# Altium schematic sheet HID.SchDoc
size A4
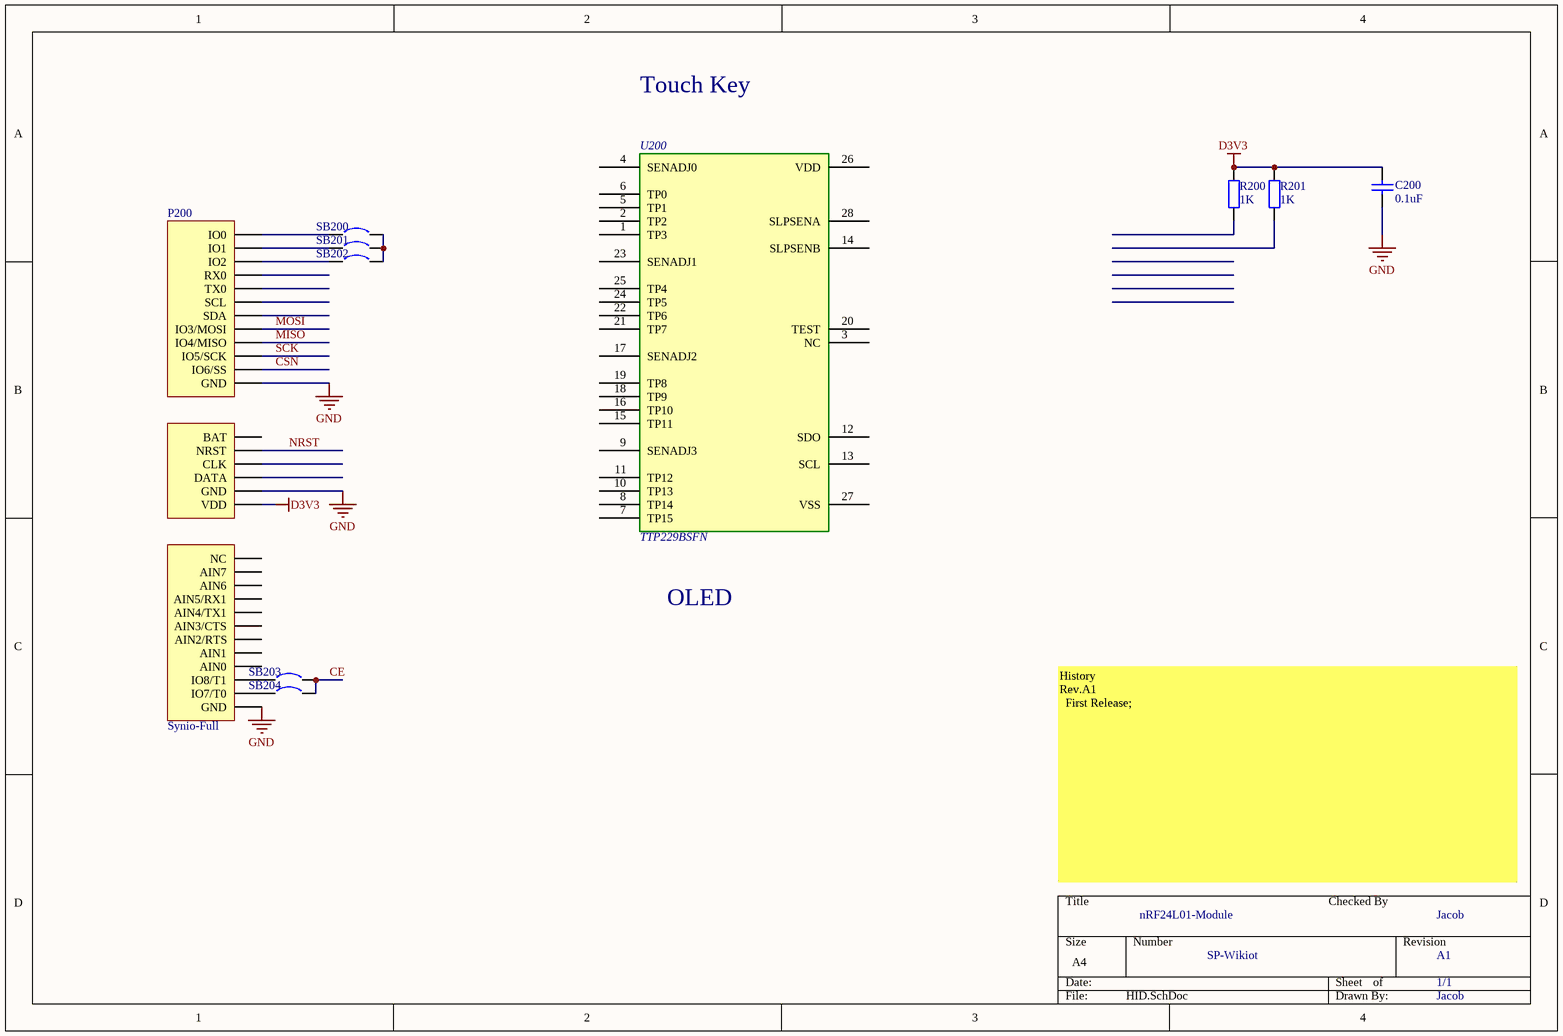
[diagram p0: HID.SchDoc]

## Parts
C200  0.1uF  [C0603L]
P200  Synio-Full  [Synio-Full]
R200  1K  [R0603]
R201  1K  [R0603]
SB200  Circuit Breaker  [JP2_SMD]  (value not drawn)
SB201  Circuit Breaker  [JP2_SMD]  (value not drawn)
SB202  Circuit Breaker  [JP2_SMD]  (value not drawn)
SB203  Circuit Breaker  [JP2_SMD]  (value not drawn)
SB204  Circuit Breaker  [JP2_SMD]  (value not drawn)
U200  TTP229BSFN  [TSSOP28]

## Nets
D3V3: C200.1 P200.18(VDD) R200.1 R201.1
GND: C200.2 P200.12(GND) P200.17(GND) P200.19(GND)
CE: SB203.2 SB204.2
CSN: P200.11(IO6/SS)
MISO: P200.9(IO4/MISO)
MOSI: P200.8(IO3/MOSI)
NRST: P200.14(NRST)
SCK: P200.10(IO5/SCK)
NetP200_1: P200.1(IO0) SB200.1
NetP200_2: P200.2(IO1) SB201.1
NetP200_3: P200.3(IO2) SB202.1
NetP200_20: P200.20(IO7/T0) SB204.1
NetP200_21: P200.21(IO8/T1) SB203.1
NetSB200_2: SB200.2 SB201.2 SB202.2

Not connected (* = marked no-connect by the designer): P200 4(RX0) 5(TX0) 6(SCL) 7(SDA) 13(BAT) 15(CLK) 16(DATA) 22(AIN0) 23(AIN1) 24(AIN2/RTS) 25(AIN3/CTS) 26(AIN4/TX1) 27(AIN5/RX1) 28(AIN6) 29(AIN7) 30(NC); R200 2; R201 2; U200 1(TP3) 2(TP2) 3(NC) 4(SENADJ0) 5(TP1) 6(TP0) 7(TP15) 8(TP14) 9(SENADJ3) 10(TP13) 11(TP12) 12(SDO) 13(SCL) 14(SLPSENB) 15(TP11) 16(TP10) 17(SENADJ2) 18(TP9) 19(TP8) 20(TEST) 21(TP7) 22(TP6) 23(SENADJ1) 24(TP5) 25(TP4) 26(VDD) 27(VSS) 28(SLPSENA)

## Notes on the sheet
- Touch Key
- OLED
- History
  Rev.A1
  First Release;
- nRF24L01-Module
- Checked By
- Jacob
- SP-Wikiot
- A1
- 1/1

## Library data of the parts
C200 = Cap: Capacitor; Published: 8-Jun-2000; LatestRevisionDate: 17-Jul-2002; LatestRevisionNote: Re-released for DXP Platform.; PackageReference: RAD-0.3; Value: 0.1uF
P200 = Synio-Full: Synio-Full Header
R200 R201 = Res: Resistor; Published: 8-Jun-2000; LatestRevisionDate: 17-Jul-2002; LatestRevisionNote: Re-released for DXP Platform.; PackageReference: AXIAL-0.4; Publisher: Altium Limited; Value: 1K
SB200-SB204 = Circuit Breaker: Solder: YES; Published: 24-Mar-1999; Revision: July-2002: Re-released for DXP Platform.; Publisher: Altium Limited
U200 = TP229BSFN: TOUCH PAD DETECTOR IC